# Altium schematic sheet DAC Amplifier.SchDoc
size 297 x 209 mm; CompanyName: Sainsbury Wellcome Centre; Organization: FabLab; Address1: Sainsbury Wellcome Centre; Address2: 25 Howland Street; Address3: London; Address4: W1T 4JG; DocumentNumber: 12; SheetNumber: 12; SheetTotal: 12; swcgroup: FabLab; Org: Sainsbury Wellcome Centre; Add1: 25 Howland Street; Add2: London; Add3: W1T 4JG; WebAddress: www.sainsburywellcome.org; SheetSize: A4; SheetName: Level Shifter
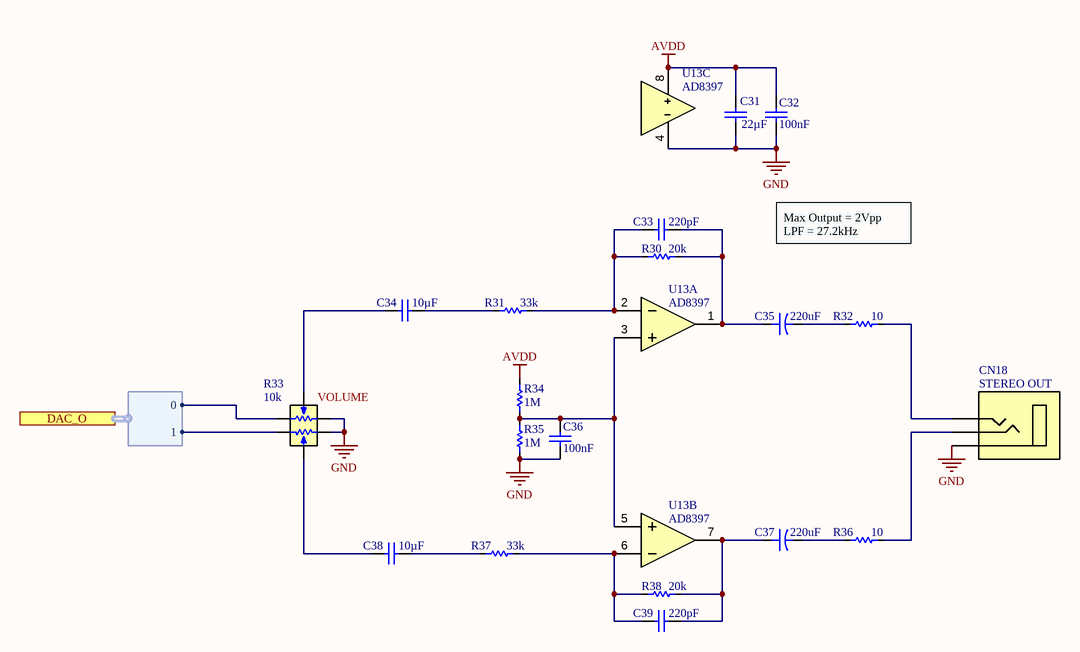
[diagram p0: DAC Amplifier.SchDoc]

## Parts
C31  value 22µF  [CAP_CHIP_0805]  (hidden comment: C0805-22uF-25V)
C32  value 100nF  [CAP_CHIP_0603]  (hidden comment: C0603-100nF-50V)
C33  value 220pF  [CAP_CHIP_0603]  (hidden comment: C0603-220pF-50V)
C34  value 10µF  [CAP_CHIP_0603]  (hidden comment: C0603-10uF-25V)
C35  value 220uF  [ECAP_SMD_6.3X5.4]  (hidden comment: EC63-220uF-10V)
C36  value 100nF  [CAP_CHIP_0603]  (hidden comment: C0603-100nF-50V)
C37  value 220uF  [ECAP_SMD_6.3X5.4]  (hidden comment: EC63-220uF-10V)
C38  value 10µF  [CAP_CHIP_0603]  (hidden comment: C0603-10uF-25V)
C39  value 220pF  [CAP_CHIP_0603]  (hidden comment: C0603-220pF-50V)
CN18  STEREO OUT  [PJ-3920]
R30  value 20k  [RES_CHIP_0603]  (hidden comment: R0603-20K)
R31  value 33k  [RES_CHIP_0603]  (hidden comment: R0603-33K)
R32  value 10  [RES_CHIP_1206]  (hidden comment: R1206-10R)
R33  VOLUME  value 10k  [VR_RK12L12C]
R34  value 1M  [RES_CHIP_0603]  (hidden comment: R0603-1M)
R35  value 1M  [RES_CHIP_0603]  (hidden comment: R0603-1M)
R36  value 10  [RES_CHIP_1206]  (hidden comment: R1206-10R)
R37  value 33k  [RES_CHIP_0603]  (hidden comment: R0603-33K)
R38  value 20k  [RES_CHIP_0603]  (hidden comment: R0603-20K)
U13  AD8397  [SOIC8_AD8397]  (parts A,B,C of 3)

## Ports
DAC_O (harness DAC_O)

## Harnesses
DAC_O: 1, 0

## Nets
AVDD: C31.2 C32.2 R34.2 U13.8(V+)
GND: C31.1 C32.1 C36.1 CN18.1(S) R33.1(TOP_A) R33.4(TOP_B) R35.1 U13.4(V-)
NetC33_1: C33.1 R30.1 R31.2 U13.2(A-)
NetC33_2: C33.2 C35.1 R30.2 U13.1(AOUT)
NetC34_1: C34.1 R33.3(TAP_A)
NetC34_2: C34.2 R31.1
NetC35_2: C35.2 R32.1
NetC36_2: C36.2 R34.1 R35.2 U13.3(A+) U13.5(B+)
NetC37_1: C37.1 C39.2 R38.2 U13.7(BOUT)
NetC37_2: C37.2 R36.1
NetC38_1: C38.1 R33.6(TAP_B)
NetC38_2: C38.2 R37.1
NetC39_1: C39.1 R37.2 R38.1 U13.6(B-)
NetCN18_2: CN18.2(T) R32.2
NetCN18_3: CN18.3(R) R36.2
NetR33_2: R33.2(BOT_A) ; port DAC_O.0
NetR33_5: R33.5(BOT_B) ; port DAC_O.1

## Notes on the sheet
- Max Output = 2Vpp
  LPF = 27.2kHz
- FILE
- VARIANT
- DATE
- REVISION
- SHEET
- /
- PROJECT
- SIZE

## Library data of the parts
C31 = CMP-611-0000-9: 0805 Multilayer Ceramic Capacitors MLCC; PartNumber: CL21A226MAQNNNE; Voltage Rating: 25V; Tolerance: 20%; Dielectric: X5R; Pick&PlaceFootprint: C0805; LCSC Part N.: C45783; Mount: SMD; RoHS: Yes; Capacitor Type: Ceramic; Case/Package: 0805
C32 C36 = CMP-611-0027-24: 0603 Multilayer Ceramic Capacitors MLCC; PartNumber: CC0603KRX7R9BB104; Pick&PlaceFootprint: C0603; Dielectric: X7R; Voltage Rating: 50V; Tolerance: 10%; Case/Package: 0603; Capacitor Type: Ceramic; LCSC Part N.: C14663; Mount: SMD; RoHS: Yes
C33 C39 = CMP-611-0075-1: 0603 Multilayer Ceramic Capacitors MLCC; PartNumber: CL10B221KB8NNNC; Dielectric: X7R; Pick&PlaceFootprint: C0603; Tolerance: 10%; Voltage Rating: 50V; LCSC Part N.: C1603; Case/Package: 0603; Capacitor Type: Ceramic; RoHS: Yes; Mount: SMD
C34 C38 = CMP-611-0050-6: 0603 Multilayer Ceramic Capacitors MLCC; PartNumber: CL10A106MA8NRNC; Dielectric: X5R; Voltage Rating: 25V; Tolerance: 20%; Pick&PlaceFootprint: C0603; Case/Package: 0603; Mount: SMD; LCSC Part N.: C96446; RoHS: Yes; Capacitor Type: Ceramic
C35 C37 = CMP-612-0008-1: 10µF ±20% 50V SMD Aluminum Electrolytic Capacitor Surface Mount D; PartNumber: CK1A221M-CRE54; Pick&PlaceFootprint: EC63; Voltage Rating: 10V; Mount: Surface Mount; Capacitor Type: Electrolytic; RoHS: Yes; Tolerance: 20%; LCSC Part N.: C18214277
CN18 = CMP-380-0042-2: 3.5mm Headphone Jack 30V 500mA Plugin Audio Connectors; PartNumber: PJ-3920-3A; Gender: Female; IEC Conformance: No; LCSC Part N.: C707259; Mount: Through Hole; Pitch: 3.5mm; Orientation: Vertical
R30 R38 = CMP-633-0126-1: 100mW Thick Film Resistors 75V ±100ppm/℃ ±1% 0603 Chip Resistor; PartNumber: 0603WAF2002T5E; Pick&PlaceFootprint: R0603; Number of Resistors: 1; Case/Package: 0603; Tolerance: 1%; Voltage Rating: 75V; Power Rating: 100mW; Mount: Surface Mount; LCSC Part N.: C4184
R31 R37 = CMP-633-0105-10: 100mW Thick Film Resistors 75V ±100ppm/℃ ±1% 0603 Chip Resistor; PartNumber: 0603WAF3302T5E; Pick&PlaceFootprint: R0603; Number of Resistors: 1; Tolerance: 1%; Mount: Surface Mount; Voltage Rating: 75V; LCSC Part N.: C4216; Case/Package: 0603; Power Rating: 100mW
R32 R36 = CMP-633-0157-3: Res Thick Film 1206 10 Ohm 5% 0.75W(3/4W) ±200ppm/C Pad SMD Automotive T/R; PartNumber: CRCW120610R0JNEAHP; Pick&PlaceFootprint: 1206; Power Rating: 750mW; Number of Resistors: 1; Voltage Rating: 200V; Tolerance: 5%; Case/Package: 1206; Mount: Surface Mount; LCSC Part N.: C3008858
R33 = CMP-632-0007-2: Res POT 10K Ohm 20% 1(Elec)/1(Mech)Turns 6mm (13 X 28.5mm) Snap-In Panel Mount; PartNumber: RK12L12C0A0E; Power Rating: 50mW; Voltage Rating: 10V; Hole Diameter: 0.8mm; Type: Potentiometer; LCSC Part N.: C470285; Tolerance: 20%; RoHS: Yes; Mount: SMD
R34 R35 = CMP-633-0066-20: 100mW Thick Film Resistors 75V ±100ppm/℃ ±1% 0603 Chip Resistor; PartNumber: 0603WAF1004T5E; Number of Resistors: 1; Pick&PlaceFootprint: R0603; Voltage Rating: 75V; Mount: Surface Mount; LCSC Part N.: C22935; Power Rating: 100mW; Tolerance: 1%; Case/Package: 0603
U13 = CMP-941-0018-4: Op Amp Dual High Output Current Amplifier R-R O/P ±12.6V/25.2V 8-Pin SOIC N EP Tube; PartNumber: AD8397ARDZ; Quiescent Current: 11mA; Min Supply Voltage: 3V; PSRR: 95dB; Slew Rate: 53V/µs; Max Supply Voltage: 25.2V; Voltage Drift: 4.5µV/°C; Input Offset Voltage: 65µV; CMRR: 90dB; Gain Bandwidth: 69MHz; Max Output Current: 310mA; LCSC Part N.: C90876